# Altium project testrack_carrier_debugger.PrjPcb
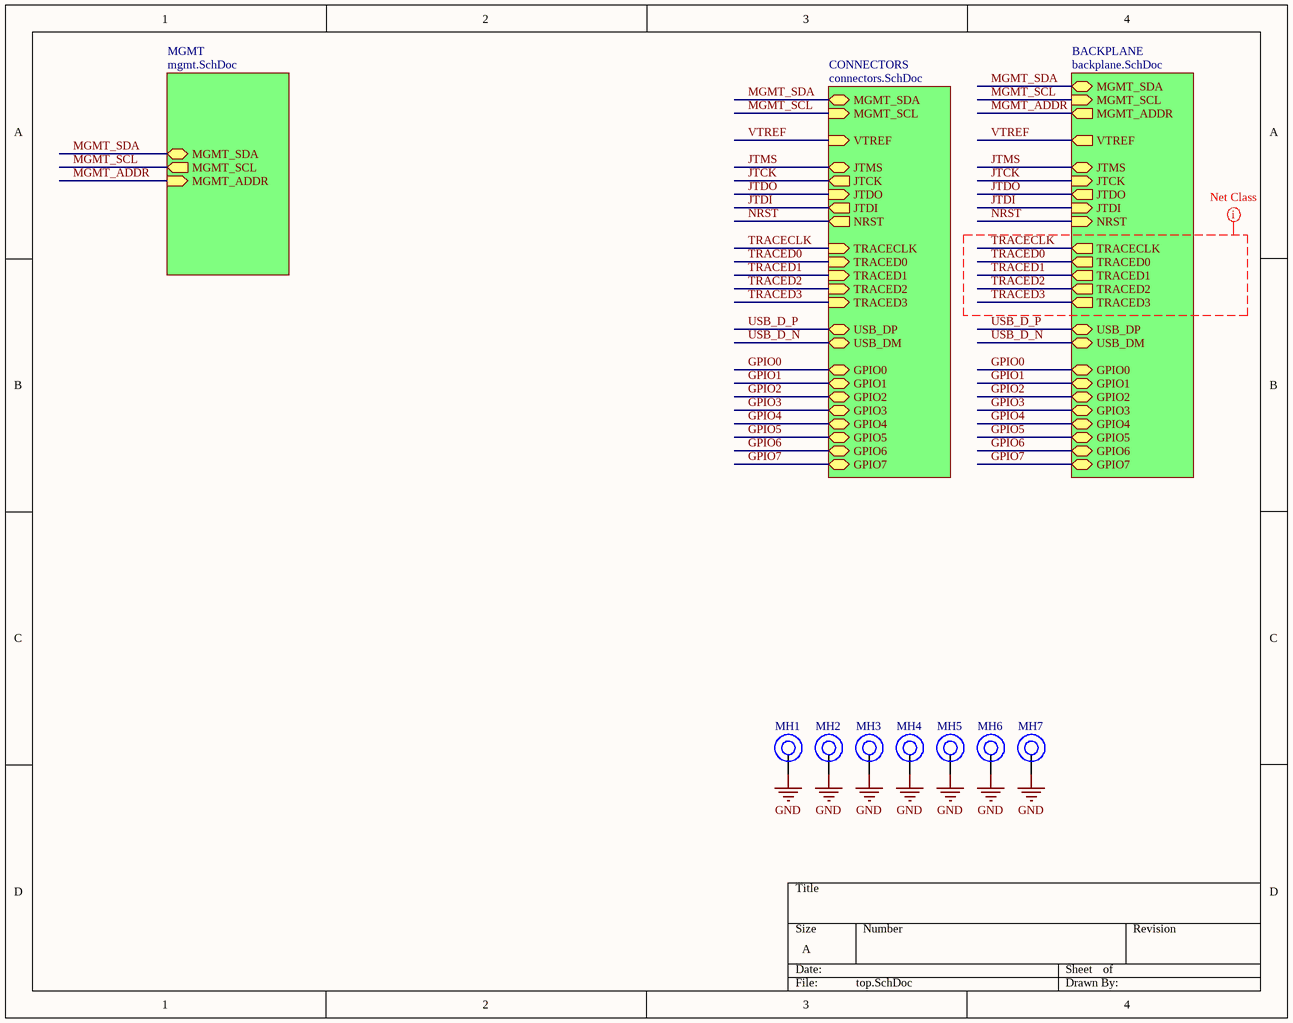
[diagram p0: top.SchDoc]
4 sheets, 40 parts. Net scope: hierarchical (ports join the sheet entries above them; power ports are global).
Board file: testrack_carrier_debugger.PcbDoc
Sheets:
  top.SchDoc
    BACKPLANE = backplane.SchDoc
    MGMT = mgmt.SchDoc
    CONNECTORS = connectors.SchDoc

## Sheet top.SchDoc
size A

### Parts
MH1  Mounting_Hole  [WA-SMSI_M2.5]  (value not drawn)
MH2  Mounting_Hole  [WA-SMSI_M2.5]  (value not drawn)
MH3  Mounting_Hole  [WA-SMSI_M2.5]  (value not drawn)
MH4  Mounting_Hole  [WA-SMSI_M2.5]  (value not drawn)
MH5  Mounting_Hole  [WA-SMSI_M2.5]  (value not drawn)
MH6  Mounting_Hole  [WA-SMSI_M2.5]  (value not drawn)
MH7  Mounting_Hole  [WA-SMSI_M2.5]  (value not drawn)

### Sub-sheets
BACKPLANE = backplane.SchDoc: JTCK (in), GPIO1 (bidir), GPIO0 (bidir), TRACED0 (out), GPIO6 (bidir), USB_DP (bidir), NRST (in), USB_DM (bidir), MGMT_SDA (bidir), GPIO5 (bidir), JTDO (out), GPIO7 (bidir), GPIO3 (bidir), VTREF (out), TRACED2 (out), GPIO2 (bidir), TRACECLK (out), GPIO4 (bidir), MGMT_SCL (in), JTMS (bidir), TRACED3 (out), TRACED1 (out), JTDI (in), MGMT_ADDR (out)
CONNECTORS = connectors.SchDoc: JTCK (out), GPIO1 (bidir), GPIO0 (bidir), TRACED0 (in), GPIO6 (bidir), USB_DP (bidir), NRST (out), USB_DM (bidir), MGMT_SDA (bidir), GPIO5 (bidir), JTDO (in), GPIO7 (bidir), GPIO3 (bidir), VTREF (in), TRACED2 (in), GPIO2 (bidir), TRACECLK (in), GPIO4 (bidir), MGMT_SCL (in), JTMS (bidir), TRACED3 (in), TRACED1 (in), JTDI (out)
MGMT = mgmt.SchDoc: MGMT_SDA (bidir), MGMT_SCL (out), MGMT_ADDR (in)

### Nets
GND: MH1.1 MH2.1 MH3.1 MH4.1 MH5.1 MH6.1 MH7.1
GPIO0: sheet BACKPLANE/GPIO0, sheet CONNECTORS/GPIO0
GPIO1: sheet BACKPLANE/GPIO1, sheet CONNECTORS/GPIO1
GPIO2: sheet BACKPLANE/GPIO2, sheet CONNECTORS/GPIO2
GPIO3: sheet BACKPLANE/GPIO3, sheet CONNECTORS/GPIO3
GPIO4: sheet BACKPLANE/GPIO4, sheet CONNECTORS/GPIO4
GPIO5: sheet BACKPLANE/GPIO5, sheet CONNECTORS/GPIO5
GPIO6: sheet BACKPLANE/GPIO6, sheet CONNECTORS/GPIO6
GPIO7: sheet BACKPLANE/GPIO7, sheet CONNECTORS/GPIO7
JTCK: sheet BACKPLANE/JTCK, sheet CONNECTORS/JTCK
JTDI: sheet BACKPLANE/JTDI, sheet CONNECTORS/JTDI
JTDO: sheet BACKPLANE/JTDO, sheet CONNECTORS/JTDO
JTMS: sheet BACKPLANE/JTMS, sheet CONNECTORS/JTMS
MGMT_ADDR: sheet BACKPLANE/MGMT_ADDR, sheet MGMT/MGMT_ADDR  [project net ADDR]
MGMT_SCL: sheet BACKPLANE/MGMT_SCL, sheet MGMT/MGMT_SCL, sheet CONNECTORS/MGMT_SCL
MGMT_SDA: sheet BACKPLANE/MGMT_SDA, sheet MGMT/MGMT_SDA, sheet CONNECTORS/MGMT_SDA
NRST: sheet BACKPLANE/NRST, sheet CONNECTORS/NRST
TRACECLK: sheet BACKPLANE/TRACECLK, sheet CONNECTORS/TRACECLK
TRACED0: sheet BACKPLANE/TRACED0, sheet CONNECTORS/TRACED0
TRACED1: sheet BACKPLANE/TRACED1, sheet CONNECTORS/TRACED1
TRACED2: sheet BACKPLANE/TRACED2, sheet CONNECTORS/TRACED2
TRACED3: sheet BACKPLANE/TRACED3, sheet CONNECTORS/TRACED3
USB_D_N: sheet BACKPLANE/USB_DM, sheet CONNECTORS/USB_DM  [project net D_N]
USB_D_P: sheet BACKPLANE/USB_DP, sheet CONNECTORS/USB_DP  [project net D_P]
VTREF: sheet BACKPLANE/VTREF, sheet CONNECTORS/VTREF

### Layout directives
net class TRACE: TRACECLK, TRACED0, TRACED1, TRACED2, TRACED3

## Sheet backplane.SchDoc
size A
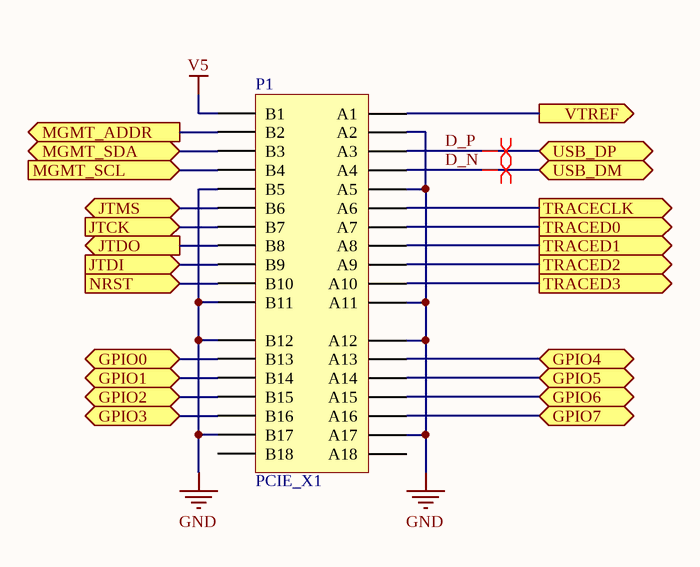
[diagram p1: backplane.SchDoc]

### Parts
P1  PCIE_X1  [PCIE_X1_EDGE]

### Ports
GPIO0 (bidir), GPIO1 (bidir), GPIO2 (bidir), GPIO3 (bidir), GPIO4 (bidir), GPIO5 (bidir), GPIO6 (bidir), GPIO7 (bidir), JTCK (in), JTDI (in), JTDO (out), JTMS (bidir), MGMT_ADDR (out), MGMT_SCL (in), MGMT_SDA (bidir), NRST (in), TRACECLK (out), TRACED0 (out), TRACED1 (out), TRACED2 (out), TRACED3 (out), USB_DM (bidir), USB_DP (bidir), VTREF (out)

### Nets
GND: P1.A2 P1.A5 P1.A11 P1.A12 P1.A17 P1.B5 P1.B11 P1.B12 P1.B17
V5: P1.B1
ADDR: P1.B2 ; port MGMT_ADDR
D_N: P1.A4 ; port USB_DM
D_P: P1.A3 ; port USB_DP
GPIO0: P1.B13 ; port GPIO0
GPIO1: P1.B14 ; port GPIO1
GPIO2: P1.B15 ; port GPIO2
GPIO3: P1.B16 ; port GPIO3
GPIO4: P1.A13 ; port GPIO4
GPIO5: P1.A14 ; port GPIO5
GPIO6: P1.A15 ; port GPIO6
GPIO7: P1.A16 ; port GPIO7
JTCK: P1.B7 ; port JTCK
JTDI: P1.B9 ; port JTDI
JTDO: P1.B8 ; port JTDO
JTMS: P1.B6 ; port JTMS
MGMT_SCL: P1.B4 ; port MGMT_SCL
MGMT_SDA: P1.B3 ; port MGMT_SDA
NRST: P1.B10 ; port NRST
TRACECLK: P1.A6 ; port TRACECLK
TRACED0: P1.A7 ; port TRACED0
TRACED1: P1.A8 ; port TRACED1
TRACED2: P1.A9 ; port TRACED2
TRACED3: P1.A10 ; port TRACED3
VTREF: P1.A1 ; port VTREF

Not connected (* = marked no-connect by the designer): P1 A18 B18

### Layout directives
differential pair: D_N, D_P

## Sheet mgmt.SchDoc
size A
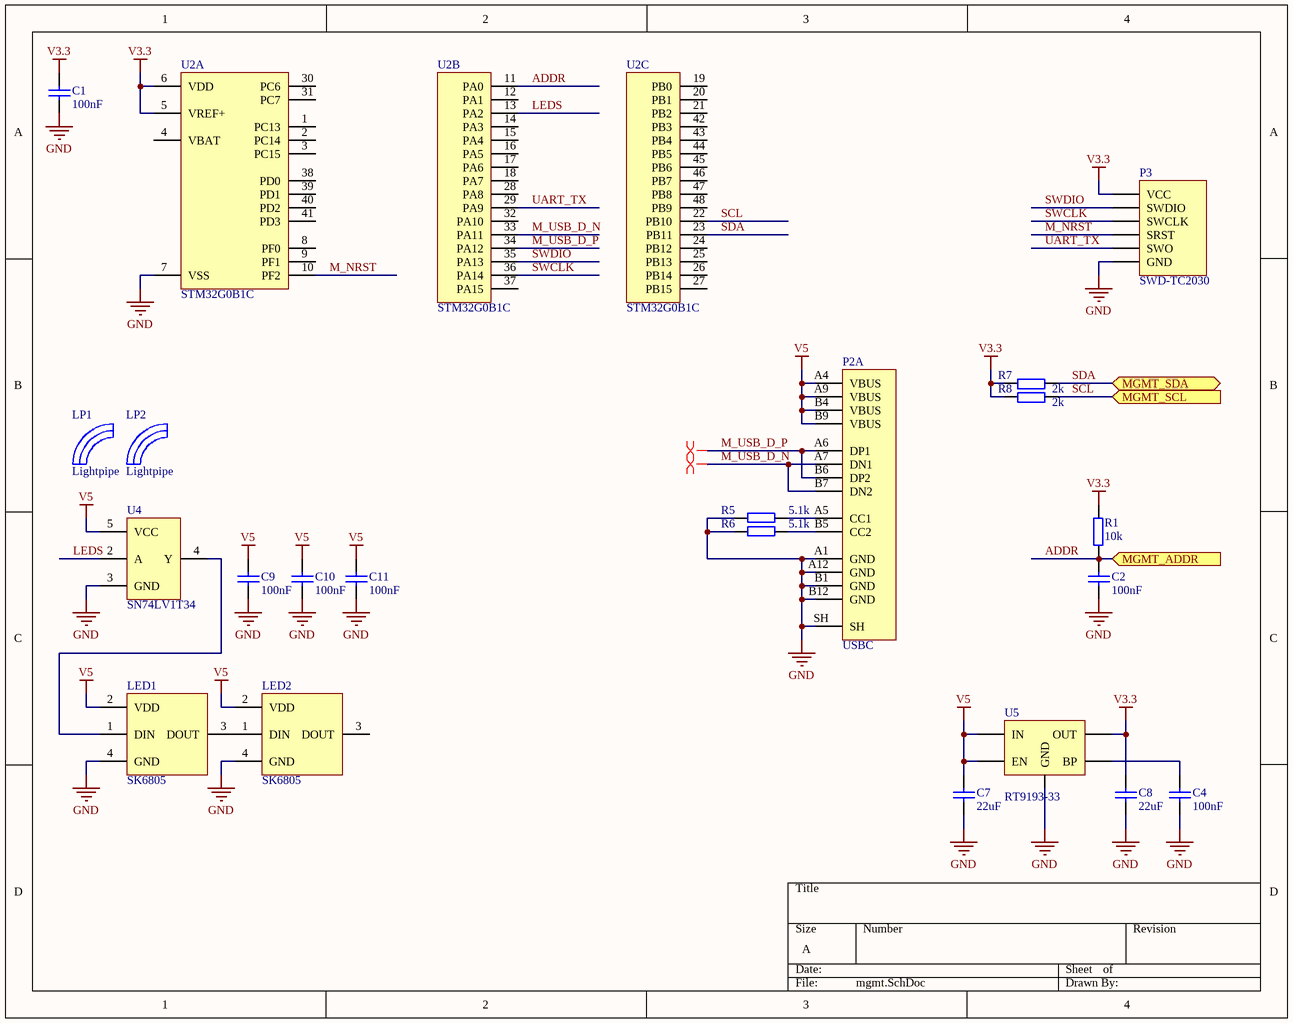
[diagram p2: mgmt.SchDoc]

### Parts
C1  100nF  [0402]
C2  100nF  [0402]
C4  100nF  [0402]
C7  22uF  [0805]
C8  22uF  [0805]
C9  100nF  [0402]
C10  100nF  [0402]
C11  100nF  [0402]
LED1  SK6805  [EC15]
LED2  SK6805  [EC15]
LP1  Lightpipe  [SLP3-150-100-F]
LP2  Lightpipe  [SLP3-150-100-F]
P2  USBC  [U262-161N-4BVC11]  (part A of 2)
P3  SWD-TC2030  [TC2030-NL]
R1  10k  [0402]
R5  5.1k  [0402]
R6  5.1k  [0402]
R7  2k  [0402]
R8  2k  [0402]
U2  STM32G0B1C  [QFP48]  (parts A,B,C of 3)
U4  SN74LV1T34  [SOT23-5]
U5  RT9193-33  [SOT23-5]

### Ports
MGMT_ADDR (in), MGMT_SCL (in), MGMT_SDA (bidir)

### Nets
GND: C1.1 C2.1 C4.1 C7.1 C8.1 C9.1 C10.1 C11.1 LED1.4(GND) LED2.4(GND) P2.A1(GND) P2.A12(GND) P2.B1(GND) P2.B12(GND) P2.SH P3.GND R5.1 R6.1 U2.7(VSS) U4.3(GND) U5.GND
V3.3: C1.2 C8.2 P3.VCC R1.2 R7.2 R8.2 U2.5(VREF+) U2.6(VDD) U5.OUT
V5: C7.2 C9.2 C10.2 C11.2 LED1.2(VDD) LED2.2(VDD) P2.A4(VBUS) P2.A9(VBUS) P2.B4(VBUS) P2.B9(VBUS) U4.5(VCC) U5.EN U5.IN
ADDR: C2.2 R1.1 U2.11(PA0) ; port MGMT_ADDR
LEDS: U2.13(PA2) U4.2(A)
M_NRST: P3.SRST U2.10(PF2)
M_USB_D_N: P2.A7(DN1) P2.B7(DN2) U2.33(PA11)
M_USB_D_P: P2.A6(DP1) P2.B6(DP2) U2.34(PA12)
SCL: R8.1 U2.22(PB10) ; port MGMT_SCL  [project net MGMT_SCL]
SDA: R7.1 U2.23(PB11) ; port MGMT_SDA  [project net MGMT_SDA]
SWCLK: P3.SWCLK U2.36(PA14)
SWDIO: P3.SWDIO U2.35(PA13)
UART_TX: P3.SWO U2.29(PA9)
NetC4_2: C4.2 U5.BP
NetLED1_1: LED1.1(DIN) U4.4(Y)
NetLED1_3: LED1.3(DOUT) LED2.1(DIN)
NetP2_A5: P2.A5(CC1) R5.2
NetP2_B5: P2.B5(CC2) R6.2

Not connected (* = marked no-connect by the designer): LED2 3(DOUT); U2 1(PC13) 2(PC14) 3(PC15) 4(VBAT) 8(PF0) 9(PF1) 12(PA1) 14(PA3) 15(PA4) 16(PA5) 17(PA6) 18(PA7) 19(PB0) 20(PB1) 21(PB2) 24(PB12) 25(PB13) 26(PB14) 27(PB15) 28(PA8) 30(PC6) 31(PC7) 32(PA10) 37(PA15) 38(PD0) 39(PD1) 40(PD2) 41(PD3) 42(PB3) 43(PB4) 44(PB5) 45(PB6) 46(PB7) 47(PB8) 48(PB9)

### Layout directives
differential pair: M_USB_D_N, M_USB_D_P

### Library data of the parts
C1 C2 C4 C7-C11 = Capacitor
  C1 C2 C4 C9-C11: Value: 100nF
  C7 C8: Value: 22uF
P2 = USBC: pin to pad: A2>none A3>none A10>none A11>none B2>none B3>none B10>none B11>none
P3 = SWD-TC2030: pin to pad: GND>5 SRST>3 SWCLK>4 SWDIO>2 SWO>6 VCC>1
R1 R5-R8 = Resistor
  R1: Value: 10k
  R5 R6: Value: 5.1k
  R7 R8: Value: 2k
U4 = SN74LV1T34: Single Power Supply Single Buffer GATE CMOS Logic Level Shifter
U5 = VREG_EN_BP: pin to pad: BP>4 EN>3 GND>2 IN>1 OUT>5

## Sheet connectors.SchDoc
size A
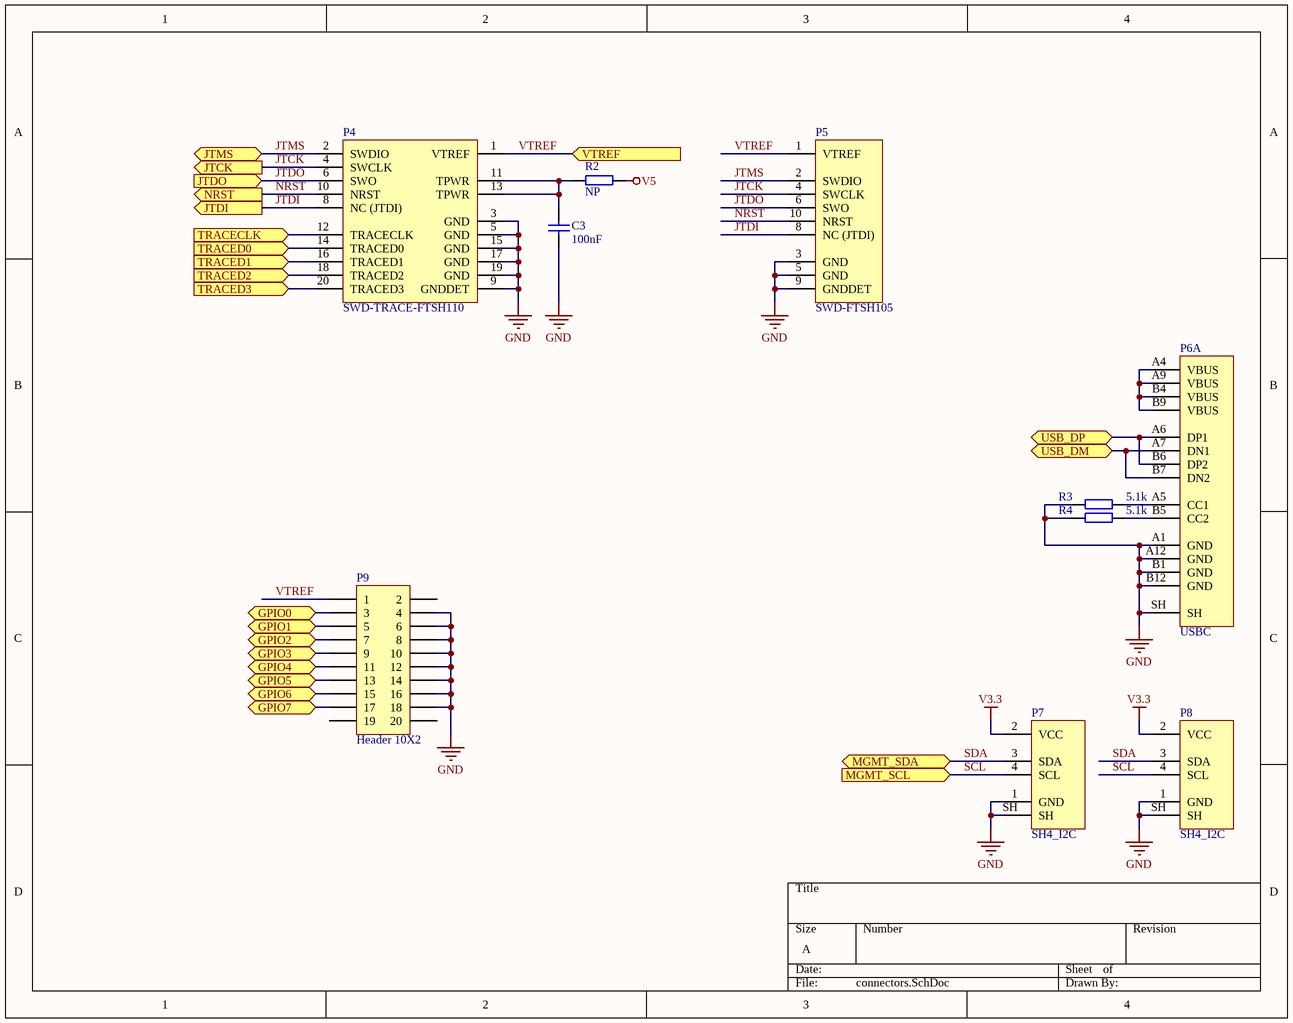
[diagram p3: connectors.SchDoc]

### Parts
C3  100nF  [0402]
P4  SWD-TRACE-FTSH110  [FTSH110]
P5  SWD-FTSH105  [FTSH105]
P6  USBC  [U262-161N-4BVC11]  (part A of 2)
P7  SH4_I2C  [SM04B]
P8  SH4_I2C  [SM04B]
P9  Header 10X2  [HDR2X10]
R2  NP  [0402]
R3  5.1k  [0402]
R4  5.1k  [0402]

### Ports
GPIO0 (bidir), GPIO1 (bidir), GPIO2 (bidir), GPIO3 (bidir), GPIO4 (bidir), GPIO5 (bidir), GPIO6 (bidir), GPIO7 (bidir), JTCK (out), JTDI (out), JTDO (in), JTMS (bidir), MGMT_SCL (in), MGMT_SDA (bidir), NRST (out), TRACECLK (in), TRACED0 (in), TRACED1 (in), TRACED2 (in), TRACED3 (in), USB_DM, USB_DP, VTREF (in)

### Nets
GND: C3.1 P4.3(GND) P4.5(GND) P4.9(GNDDET) P4.15(GND) P4.17(GND) P4.19(GND) P5.3(GND) P5.5(GND) P5.9(GNDDET) P6.A1(GND) P6.A12(GND) P6.B1(GND) P6.B12(GND) P6.SH P7.1(GND) P7.SH P8.1(GND) P8.SH P9.4 P9.6 P9.8 P9.10 P9.12 P9.14 P9.16 P9.18 R3.1 R4.1
V3.3: P7.2(VCC) P8.2(VCC)
V5: R2.2
D_N: P6.A7(DN1) P6.B7(DN2) ; port USB_DM
D_P: P6.A6(DP1) P6.B6(DP2) ; port USB_DP
GPIO0: P9.3 ; port GPIO0
GPIO1: P9.5 ; port GPIO1
GPIO2: P9.7 ; port GPIO2
GPIO3: P9.9 ; port GPIO3
GPIO4: P9.11 ; port GPIO4
GPIO5: P9.13 ; port GPIO5
GPIO6: P9.15 ; port GPIO6
GPIO7: P9.17 ; port GPIO7
JTCK: P4.4(SWCLK) P5.4(SWCLK) ; port JTCK
JTDI: P4.8(NC_(JTDI)) P5.8(NC_(JTDI)) ; port JTDI
JTDO: P4.6(SWO) P5.6(SWO) ; port JTDO
JTMS: P4.2(SWDIO) P5.2(SWDIO) ; port JTMS
NRST: P4.10(NRST) P5.10(NRST) ; port NRST
SCL: P7.4(SCL) P8.4(SCL) ; port MGMT_SCL  [project net MGMT_SCL]
SDA: P7.3(SDA) P8.3(SDA) ; port MGMT_SDA  [project net MGMT_SDA]
TRACECLK: P4.12(TRACECLK) ; port TRACECLK
TRACED0: P4.14(TRACED0) ; port TRACED0
TRACED1: P4.16(TRACED1) ; port TRACED1
TRACED2: P4.18(TRACED2) ; port TRACED2
TRACED3: P4.20(TRACED3) ; port TRACED3
VTREF: P4.1(VTREF) P5.1(VTREF) P9.1 ; port VTREF
NetC3_2: C3.2 P4.11(TPWR) P4.13(TPWR) R2.1
NetP6_A4: P6.A4(VBUS) P6.A9(VBUS) P6.B4(VBUS) P6.B9(VBUS)
NetP6_A5: P6.A5(CC1) R3.2
NetP6_B5: P6.B5(CC2) R4.2

Not connected (* = marked no-connect by the designer): P9 2 19 20

### Library data of the parts
C3 = Capacitor: Value: 100nF
P6 = USBC: pin to pad: A2>none A3>none A10>none A11>none B2>none B3>none B10>none B11>none
P7 P8 = SH4_I2C: Qwiic / STEMMA QT Compatible
P9 = Header 10X2: Header, 10-Pin, Dual row; LatestRevisionDate: 17-Jul-2002; LatestRevisionNote: Re-released for DXP Platform.; Publisher: Altium Limited
R2-R4 = Resistor
  R2: Value: NP
  R3 R4: Value: 5.1k

## Nets that join several sheets
GND: top (7 pins), backplane (9 pins), mgmt (21 pins), connectors (29 pins)
V3.3: mgmt (9 pins), connectors (P7.2 P8.2)
V5: backplane (P1.B1), mgmt (13 pins), connectors (R2.2)
ADDR: backplane (P1.B2), mgmt (C2.2 R1.1 U2.11)
D_N: backplane (P1.A4), connectors (P6.A7 P6.B7)
D_P: backplane (P1.A3), connectors (P6.A6 P6.B6)
GPIO0: backplane (P1.B13), connectors (P9.3)
GPIO1: backplane (P1.B14), connectors (P9.5)
GPIO2: backplane (P1.B15), connectors (P9.7)
GPIO3: backplane (P1.B16), connectors (P9.9)
GPIO4: backplane (P1.A13), connectors (P9.11)
GPIO5: backplane (P1.A14), connectors (P9.13)
GPIO6: backplane (P1.A15), connectors (P9.15)
GPIO7: backplane (P1.A16), connectors (P9.17)
JTCK: backplane (P1.B7), connectors (P4.4 P5.4)
JTDI: backplane (P1.B9), connectors (P4.8 P5.8)
JTDO: backplane (P1.B8), connectors (P4.6 P5.6)
JTMS: backplane (P1.B6), connectors (P4.2 P5.2)
MGMT_SCL: backplane (P1.B4), mgmt (R8.1 U2.22), connectors (P7.4 P8.4)
MGMT_SDA: backplane (P1.B3), mgmt (R7.1 U2.23), connectors (P7.3 P8.3)
NRST: backplane (P1.B10), connectors (P4.10 P5.10)
TRACECLK: backplane (P1.A6), connectors (P4.12)
TRACED0: backplane (P1.A7), connectors (P4.14)
TRACED1: backplane (P1.A8), connectors (P4.16)
TRACED2: backplane (P1.A9), connectors (P4.18)
TRACED3: backplane (P1.A10), connectors (P4.20)
VTREF: backplane (P1.A1), connectors (P4.1 P5.1 P9.1)